# Altium schematic sheet TC377TP_2.SchDoc
size A4; SheetNumber: 5; SheetTotal: 5
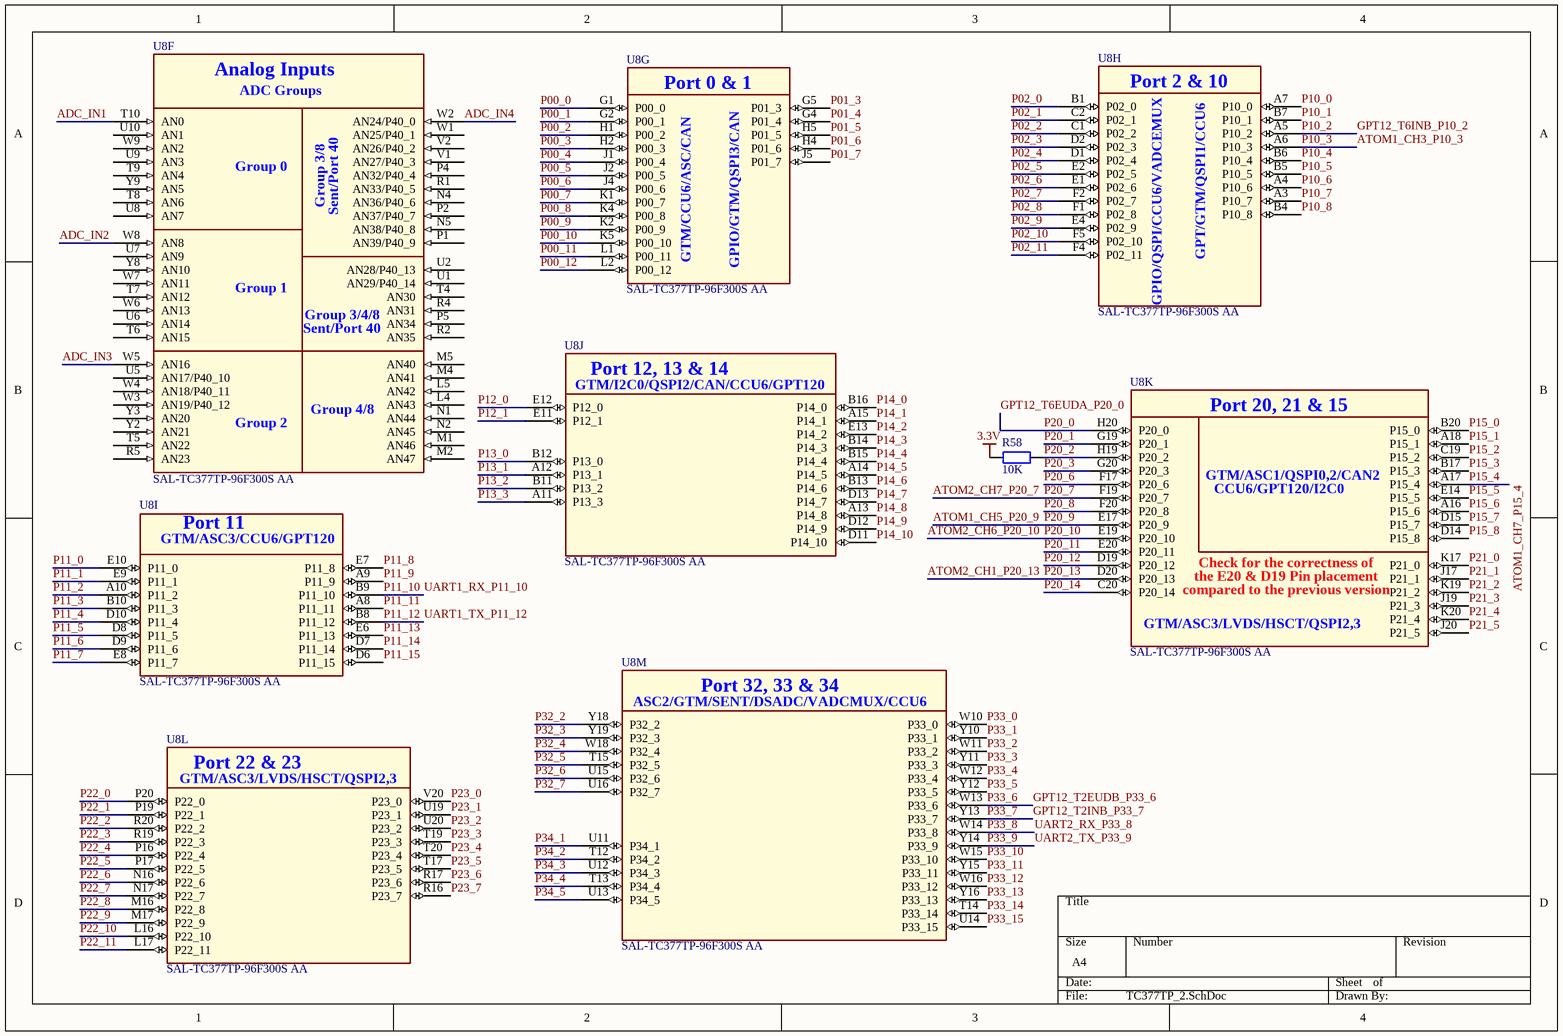
[diagram p0: TC377TP_2.SchDoc]

## Parts
R58  10K  [R 0603_L]
U8  SAL-TC377TP-96F300S AA  [BGA292C80P20X20]  (parts F,G,H,I,J,K,L,M of 13)

## Nets
3.3V: R58.2
ADC_IN1: U8.T10(AN0)
ADC_IN2: U8.W8(AN8)
ADC_IN3: U8.W5(AN16)
ADC_IN4: U8.W2(AN24/P40_0)
ATOM1_CH3_P10_3: U8.A6(P10_3)  [also labelled P10_3]
ATOM1_CH5_P20_9: U8.E17(P20_9)  [also labelled P20_9]
ATOM1_CH7_P15_4: U8.A17(P15_4)  [also labelled P15_4]
ATOM2_CH1_P20_13: U8.D20(P20_13)  [also labelled P20_13]
ATOM2_CH6_P20_10: U8.E19(P20_10)  [also labelled P20_10]
ATOM2_CH7_P20_7: U8.F19(P20_7)  [also labelled P20_7]
GPT12_T2EUDB_P33_6: U8.W13(P33_6)  [also labelled P33_6]
GPT12_T2INB_P33_7: U8.Y13(P33_7)  [also labelled P33_7]
GPT12_T6EUDA_P20_0: U8.H20(P20_0)  [also labelled P20_0]
GPT12_T6INB_P10_2: U8.A5(P10_2)  [also labelled P10_2]
P00_0: U8.G1(P00_0)
P00_1: U8.G2(P00_1)
P00_2: U8.H1(P00_2)
P00_3: U8.H2(P00_3)
P00_4: U8.J1(P00_4)
P00_5: U8.J2(P00_5)
P00_6: U8.J4(P00_6)
P00_7: U8.K1(P00_7)
P00_8: U8.K4(P00_8)
P00_9: U8.K2(P00_9)
P00_10: U8.K5(P00_10)
P00_11: U8.L1(P00_11)
P00_12: U8.L2(P00_12)
P01_3: U8.G5(P01_3)
P01_4: U8.G4(P01_4)
P01_5: U8.H5(P01_5)
P01_6: U8.H4(P01_6)
P01_7: U8.J5(P01_7)
P02_0: U8.B1(P02_0)
P02_1: U8.C2(P02_1)
P02_2: U8.C1(P02_2)
P02_3: U8.D2(P02_3)
P02_4: U8.D1(P02_4)
P02_5: U8.E2(P02_5)
P02_6: U8.E1(P02_6)
P02_7: U8.F2(P02_7)
P02_8: U8.F1(P02_8)
P02_9: U8.E4(P02_9)
P02_10: U8.F5(P02_10)
P02_11: U8.F4(P02_11)
P10_0: U8.A7(P10_0)
P10_1: U8.B7(P10_1)
P10_4: U8.B6(P10_4)
P10_5: U8.B5(P10_5)
P10_6: U8.A4(P10_6)
P10_7: U8.A3(P10_7)
P10_8: U8.B4(P10_8)
P11_0: U8.E10(P11_0)
P11_1: U8.E9(P11_1)
P11_2: U8.A10(P11_2)
P11_3: U8.B10(P11_3)
P11_4: U8.D10(P11_4)
P11_5: U8.D8(P11_5)
P11_6: U8.D9(P11_6)
P11_7: U8.E8(P11_7)
P11_8: U8.E7(P11_8)
P11_9: U8.A9(P11_9)
P11_10: U8.B9(P11_10)  [also labelled UART1_RX_P11_10]
P11_11: U8.A8(P11_11)
P11_12: U8.B8(P11_12)  [also labelled UART1_TX_P11_12]
P11_13: U8.E6(P11_13)
P11_14: U8.D7(P11_14)
P11_15: U8.D6(P11_15)
P12_0: U8.E12(P12_0)
P12_1: U8.E11(P12_1)
P13_0: U8.B12(P13_0)
P13_1: U8.A12(P13_1)
P13_2: U8.B11(P13_2)
P13_3: U8.A11(P13_3)
P14_0: U8.B16(P14_0)
P14_1: U8.A15(P14_1)
P14_2: U8.E13(P14_2)
P14_3: U8.B14(P14_3)
P14_4: U8.B15(P14_4)
P14_5: U8.A14(P14_5)
P14_6: U8.B13(P14_6)
P14_7: U8.D13(P14_7)
P14_8: U8.A13(P14_8)
P14_9: U8.D12(P14_9)
P14_10: U8.D11(P14_10)
P15_0: U8.B20(P15_0)
P15_1: U8.A18(P15_1)
P15_2: U8.C19(P15_2)
P15_3: U8.B17(P15_3)
P15_5: U8.E14(P15_5)
P15_6: U8.A16(P15_6)
P15_7: U8.D15(P15_7)
P15_8: U8.D14(P15_8)
P20_1: U8.G19(P20_1)
P20_2: R58.1 U8.H19(P20_2)
P20_3: U8.G20(P20_3)
P20_6: U8.F17(P20_6)
P20_8: U8.F20(P20_8)
P20_11: U8.E20(P20_11)
P20_12: U8.D19(P20_12)
P20_14: U8.C20(P20_14)
P21_0: U8.K17(P21_0)
P21_1: U8.J17(P21_1)
P21_2: U8.K19(P21_2)
P21_3: U8.J19(P21_3)
P21_4: U8.K20(P21_4)
P21_5: U8.J20(P21_5)
P22_0: U8.P20(P22_0)
P22_1: U8.P19(P22_1)
P22_2: U8.R20(P22_2)
P22_3: U8.R19(P22_3)
P22_4: U8.P16(P22_4)
P22_5: U8.P17(P22_5)
P22_6: U8.N16(P22_6)
P22_7: U8.N17(P22_7)
P22_8: U8.M16(P22_8)
P22_9: U8.M17(P22_9)
P22_10: U8.L16(P22_10)
P22_11: U8.L17(P22_11)
P23_0: U8.V20(P23_0)
P23_1: U8.U19(P23_1)
P23_2: U8.U20(P23_2)
P23_3: U8.T19(P23_3)
P23_4: U8.T20(P23_4)
P23_5: U8.T17(P23_5)
P23_6: U8.R17(P23_6)
P23_7: U8.R16(P23_7)
P32_2: U8.Y18(P32_2)
P32_3: U8.Y19(P32_3)
P32_4: U8.W18(P32_4)
P32_5: U8.T15(P32_5)
P32_6: U8.U15(P32_6)
P32_7: U8.U16(P32_7)
P33_0: U8.W10(P33_0)
P33_1: U8.Y10(P33_1)
P33_2: U8.W11(P33_2)
P33_3: U8.Y11(P33_3)
P33_4: U8.W12(P33_4)
P33_5: U8.Y12(P33_5)
P33_8: U8.W14(P33_8)  [also labelled UART2_RX_P33_8]
P33_9: U8.Y14(P33_9)  [also labelled UART2_TX_P33_9]
P33_10: U8.W15(P33_10)
P33_11: U8.Y15(P33_11)
P33_12: U8.W16(P33_12)
P33_13: U8.Y16(P33_13)
P33_14: U8.T14(P33_14)
P33_15: U8.U14(P33_15)
P34_1: U8.U11(P34_1)
P34_2: U8.T12(P34_2)
P34_3: U8.U12(P34_3)
P34_4: U8.T13(P34_4)
P34_5: U8.U13(P34_5)

Not connected (* = marked no-connect by the designer): U8 L4(AN43) L5(AN42) M1(AN46) M2(AN47) M4(AN41) M5(AN40) N1(AN44) N2(AN45) N4(AN36/P40_6) N5(AN38/P40_8) P1(AN39/P40_9) P2(AN37/P40_7) P4(AN32/P40_4) P5(AN34) R1(AN33/P40_5) R2(AN35) R4(AN31) R5(AN23) T4(AN30) T5(AN22) T6(AN15) T7(AN12) T8(AN6) T9(AN4) U1(AN29/P40_14) U2(AN28/P40_13) U5(AN17/P40_10) U6(AN14) U7(AN9) U8(AN7) U9(AN3) U10(AN1) V1(AN27/P40_3) V2(AN26/P40_2) W1(AN25/P40_1) W3(AN19/P40_12) W4(AN18/P40_11) W6(AN13) W7(AN11) W9(AN2) Y2(AN21) Y3(AN20) Y8(AN10) Y9(AN5)

## Notes on the sheet
- (in symbol SAL-TC377TP-96F300S AA, part F) Analog Inputs; ADC Groups; Group 0; Group 3/8; Sent/Port 40; Group 1; Group 3/4/8; Group 4/8; Group 2
- (in symbol SAL-TC377TP-96F300S AA, part G) Port 0 & 1; GTM/CCU6/ASC/CAN; GPIO/GTM/QSPI3/CAN
- (in symbol SAL-TC377TP-96F300S AA, part H) Port 2 & 10; GPT/GTM/QSPI1/CCU6; GPIO/QSPI/CCU6/VADCEMUX
- (in symbol SAL-TC377TP-96F300S AA, part I) Port 11; GTM/ASC3/CCU6/GPT120
- (in symbol SAL-TC377TP-96F300S AA, part J) Port 12, 13 & 14; GTM/I2C0/QSPI2/CAN/CCU6/GPT120
- (in symbol SAL-TC377TP-96F300S AA, part K) Port 20, 21 & 15; GTM/ASC1/QSPI0,2/CAN2; CCU6/GPT120/I2C0; Check for the correctness of; the E20 & D19 Pin placement; compared to the previous version; GTM/ASC3/LVDS/HSCT/QSPI2,3
- (in symbol SAL-TC377TP-96F300S AA, part L) Port 22 & 23; GTM/ASC3/LVDS/HSCT/QSPI2,3
- (in symbol SAL-TC377TP-96F300S AA, part M) Port 32, 33 & 34; ASC2/GTM/SENT/DSADC/VADCMUX/CCU6

## Library data of the parts
R58 = R: 贴片电阻; 版权归属: 源创客; BOM名称: 贴片电阻; 学习资源: www.ooocke.com
U8 = SAL-TC377TP-96F300S AA: 32-Bit Single-Chip Microcontroller; Manufacturer: Infineon Technologies; Manufacturer Order Number: SAL-TC377TP-96F300S AA; PackageReference: PG-LFBGA-292-11